# EAGLE schematic Talon_I2C (EAGLE 9.6.2)

## Sheet 1 of 3: Power
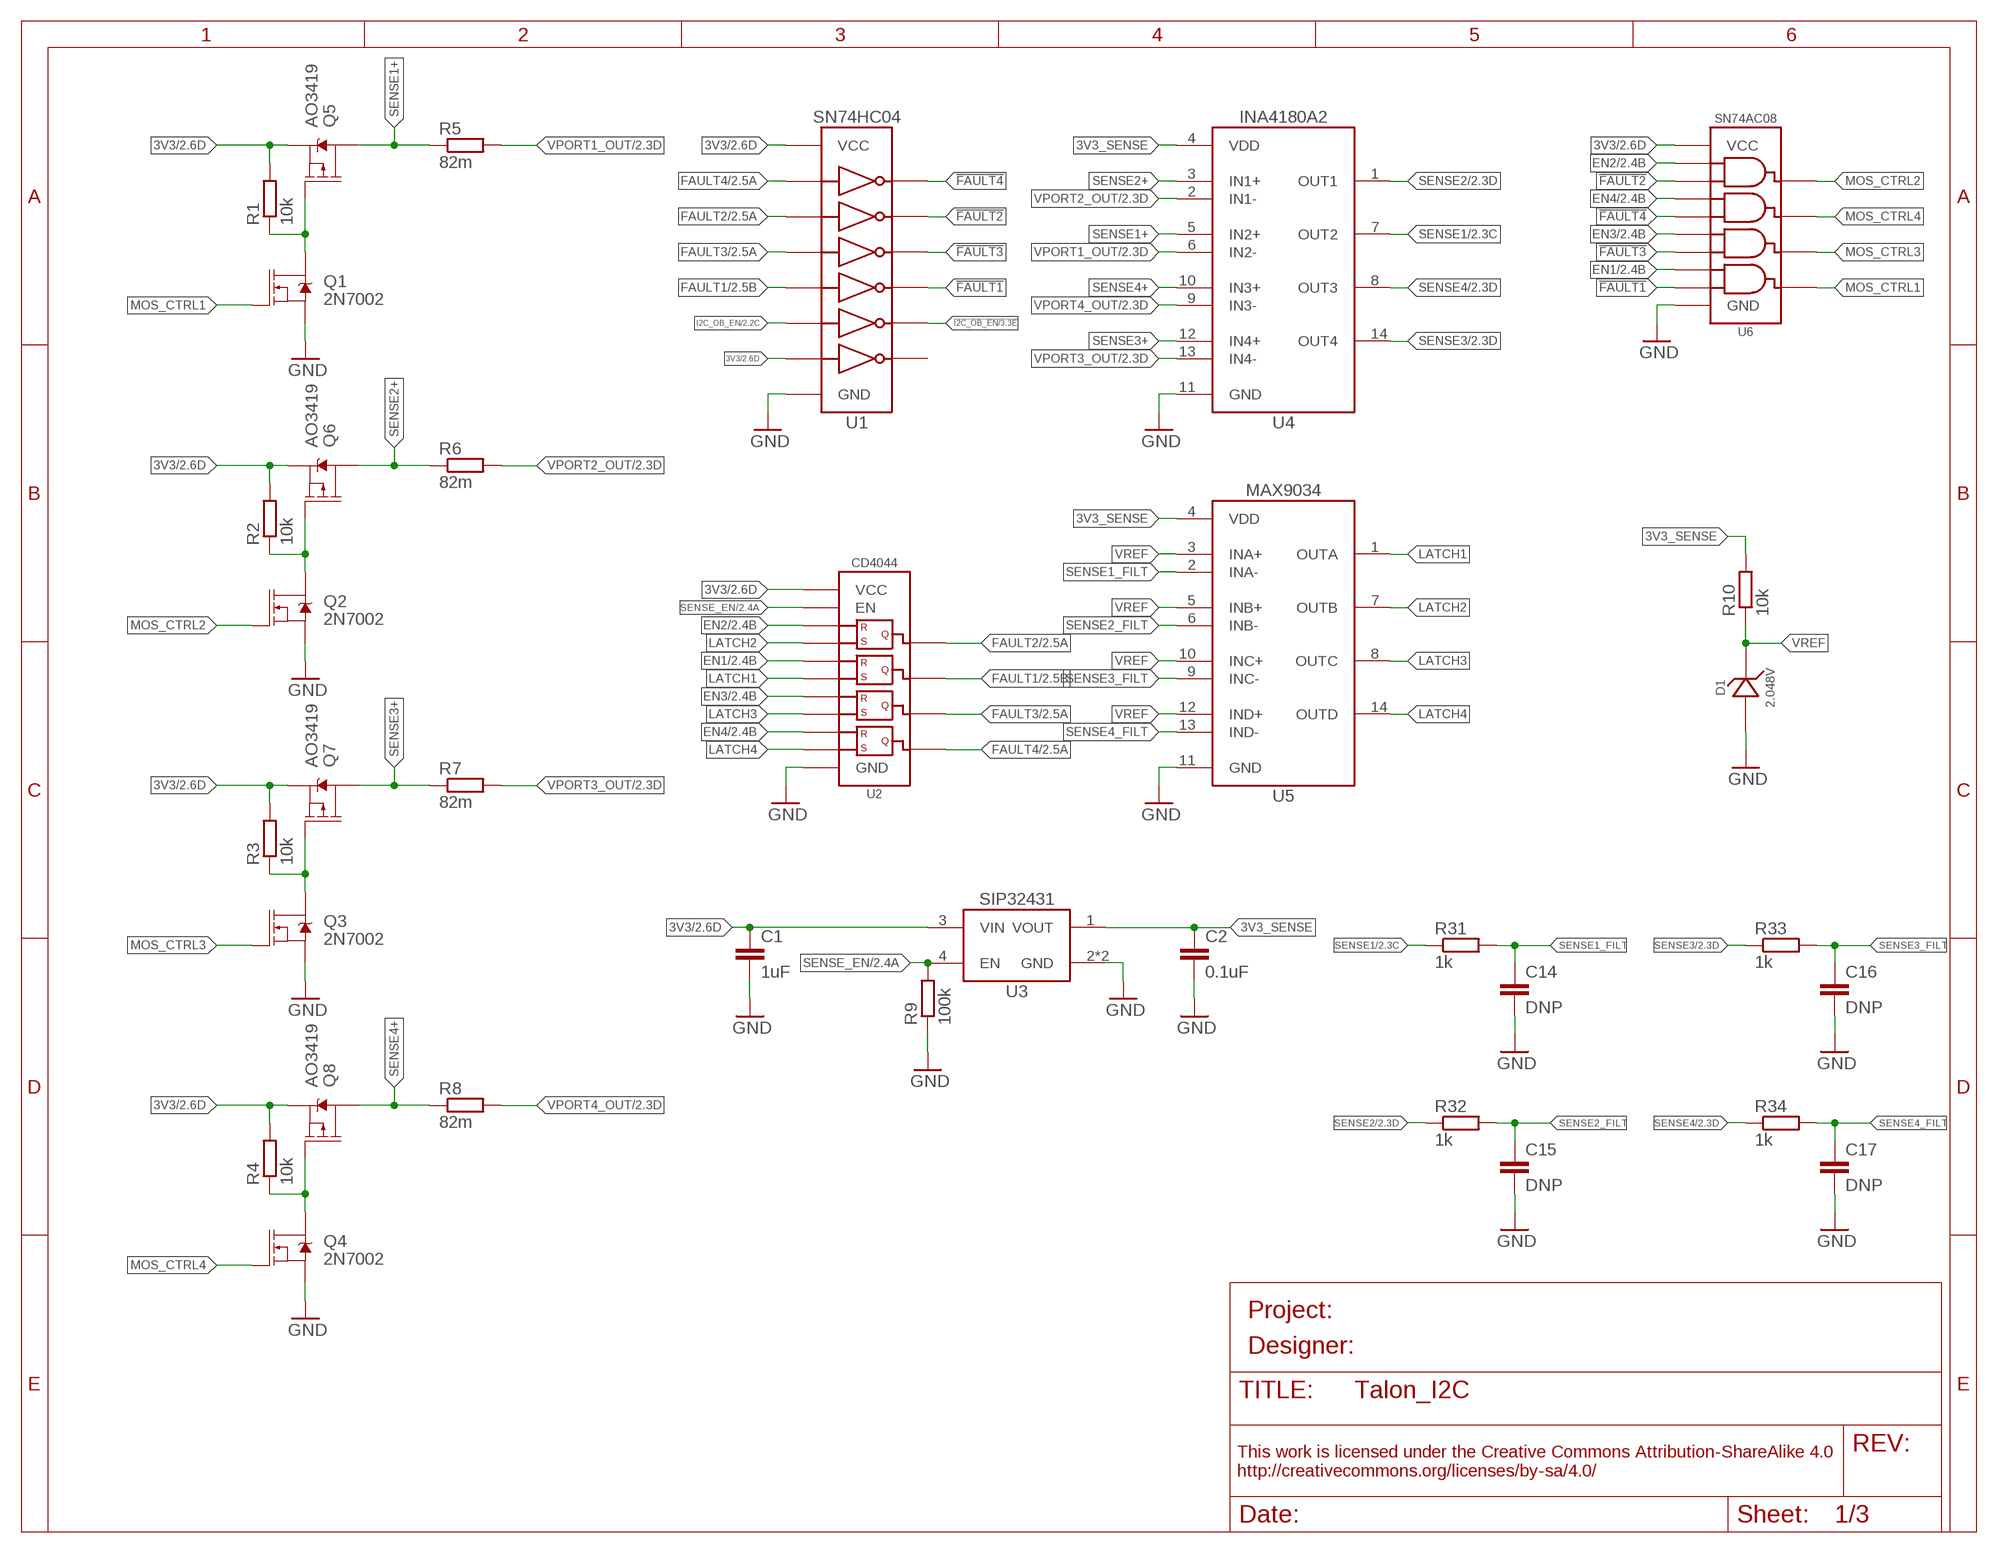
[diagram p0: schematic, sheet 1]

### Parts
C1  1uF  C-EU1UFC0603  [C0603]
C2  0.1uF  C-EU0.1UFC0402  [C0402]
C14  DNP  C-EU0.1UFC0402  [C0402]
C15  DNP  C-EU0.1UFC0402  [C0402]
C16  DNP  C-EU0.1UFC0402  [C0402]
C17  DNP  C-EU0.1UFC0402  [C0402]
D1  2.048V  LM40402.048  [SOT23-3]
Q1  2N7002  MOSFET-NCH-2N7002P  [SOT23-3]
Q2  2N7002  MOSFET-NCH-2N7002P  [SOT23-3]
Q3  2N7002  MOSFET-NCH-2N7002P  [SOT23-3]
Q4  2N7002  MOSFET-NCH-2N7002P  [SOT23-3]
Q5  AO3419  MOSFET-PCH-AO3419  [SOT23-3]
Q6  AO3419  MOSFET-PCH-AO3419  [SOT23-3]
Q7  AO3419  MOSFET-PCH-AO3419  [SOT23-3]
Q8  AO3419  MOSFET-PCH-AO3419  [SOT23-3]
R1  10k  R-EU_10KR0402  [R0402]
R2  10k  R-EU_10KR0402  [R0402]
R3  10k  R-EU_10KR0402  [R0402]
R4  10k  R-EU_10KR0402  [R0402]
R5  82m  R-EU_0.082R0603  [R0603]
R6  82m  R-EU_0.082R0603  [R0603]
R7  82m  R-EU_0.082R0603  [R0603]
R8  82m  R-EU_0.082R0603  [R0603]
R9  100k  R-EU_100KR0402  [R0402]
R10  10k  R-EU_10KR0402  [R0402]
R31  1k  R-EU_1KR0402  [R0402]
R32  1k  R-EU_1KR0402  [R0402]
R33  1k  R-EU_1KR0402  [R0402]
R34  1k  R-EU_1KR0402  [R0402]
U1  SN74HC04  [TSSOP14]
U2  CD4044  [TSSOP16]
U3  SIP32431TDFN  [TDFN_4]
U4  INA4180A2  [TSSOP14]
U5  MAX9034TSSOP  [TSSOP14]
U6  SN74AC08  [TSSOP14]

### Nets
3V3: C1.1 Q5.2(S) Q6.2(S) Q7.2(S) Q8.2(S) R1.2 R2.2 R3.2 R4.2 U1.13(A6) U1.14(VCC) U2.16(VCC) U3.3(VIN) U6.14(VCC) ; also sheet 2,3
3V3_SENSE: C2.1 R10.2 U3.1(VOUT) U4.4(VDD) U5.4(VDD)
!FAULT1: U1.8(Y4) U6.13(B4)
!FAULT2: U1.4(Y2) U6.2(B1)
!FAULT3: U1.6(Y3) U6.10(B3)
!FAULT4: U1.2(Y1) U6.5(B2)
!I2C_OB_EN: U1.10(Y5) ; also sheet 3
EN1: U2.6(R2) U6.12(A4) ; also sheet 2
EN2: U2.4(R1) U6.1(A1) ; also sheet 2
EN3: U2.12(R3) U6.9(A3) ; also sheet 2
EN4: U2.14(R4) U6.4(A2) ; also sheet 2
FAULT1: U1.9(A4) U2.9(Q2) ; also sheet 2
FAULT2: U1.3(A2) U2.13(Q1) ; also sheet 2
FAULT3: U1.5(A3) U2.10(Q3) ; also sheet 2
FAULT4: U1.1(A1) U2.1(Q4) ; also sheet 2
GND: C1.2 C2.2 C14.2 C15.2 C16.2 C17.2 D1.2(A) Q1.2(S) Q2.2(S) Q3.2(S) Q4.2(S) R9.1 U1.7(GND) U2.8(GND) U3.2(GND) U3.EP(GND) U4.11(GND) U5.11(GND) U6.7(GND) ; also sheet 2,3
I2C_OB_EN: U1.11(A5) ; also sheet 2,3
LATCH1: U2.7(S2) U5.1(OUTA)
LATCH2: U2.3(S1) U5.7(OUTB)
LATCH3: U2.11(S3) U5.8(OUTC)
LATCH4: U2.15(S4) U5.14(OUTD)
MOS_CTRL1: Q1.1(G) U6.11(Y4)
MOS_CTRL2: Q2.1(G) U6.3(Y1)
MOS_CTRL3: Q3.1(G) U6.8(Y3)
MOS_CTRL4: Q4.1(G) U6.6(Y2)
N$1: Q2.3(D) Q6.1(G) R2.1
N$2: Q1.3(D) Q5.1(G) R1.1
N$3: Q3.3(D) Q7.1(G) R3.1
N$4: Q4.3(D) Q8.1(G) R4.1
SENSE1: R31.1 U4.7(OUT2) ; also sheet 2
SENSE1+: Q5.3(D) R5.1 U4.5(IN2+)
SENSE1_FILT: C14.1 R31.2 U5.2(INA-)
SENSE2: R32.1 U4.1(OUT1) ; also sheet 2
SENSE2+: Q6.3(D) R6.1 U4.3(IN1+)
SENSE2_FILT: C15.1 R32.2 U5.6(INB-)
SENSE3: R33.1 U4.14(OUT4) ; also sheet 2
SENSE3+: Q7.3(D) R7.1 U4.12(IN4+)
SENSE3_FILT: C16.1 R33.2 U5.9(INC-)
SENSE4: R34.1 U4.8(OUT3) ; also sheet 2
SENSE4+: Q8.3(D) R8.1 U4.10(IN3+)
SENSE4_FILT: C17.1 R34.2 U5.13(IND-)
SENSE_EN: R9.2 U2.5(EN) U3.4(EN) ; also sheet 2
VPORT1_OUT: R5.2 U4.6(IN2-) ; also sheet 2,3
VPORT2_OUT: R6.2 U4.2(IN1-) ; also sheet 2,3
VPORT3_OUT: R7.2 U4.13(IN4-) ; also sheet 2,3
VPORT4_OUT: R8.2 U4.9(IN3-) ; also sheet 2,3
VREF: D1.1(C) R10.1 U5.3(INA+) U5.5(INB+) U5.10(INC+) U5.12(IND+)
Unconnected: U1.12(Y6)

## Sheet 2 of 3: Core
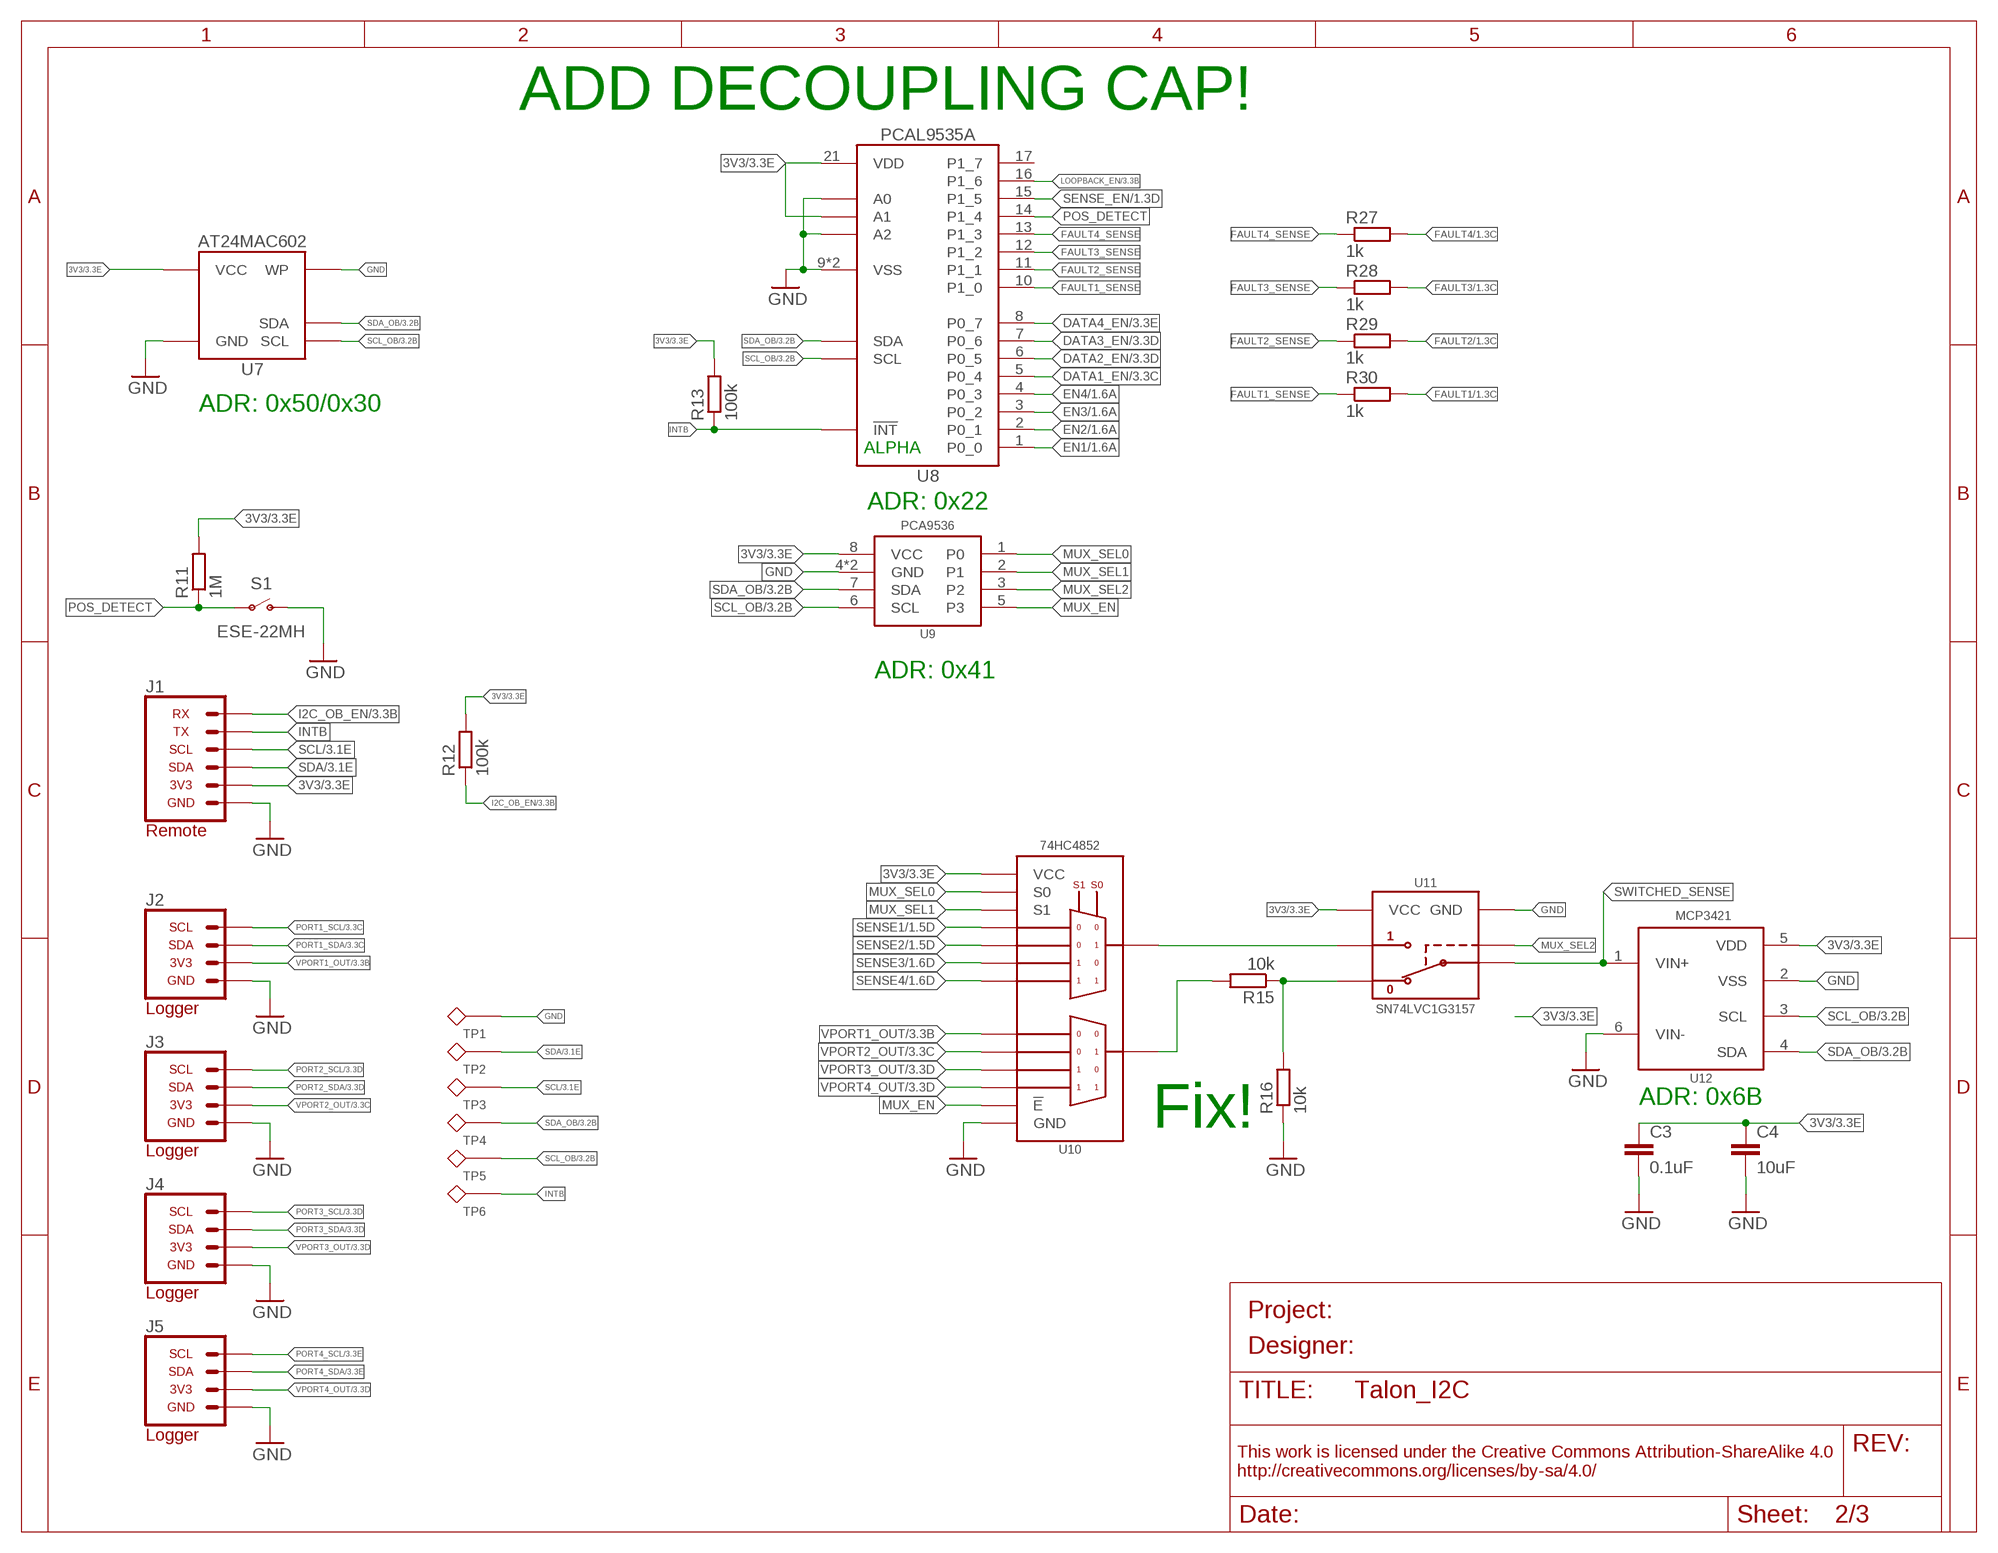
[diagram p1: schematic, sheet 2]

### Parts
C3  0.1uF  C-EU0.1UFC0402  [C0402]
C4  10uF  C-EU10UFC0805  [C0805]
J1  CONN_TALON_REMOTE  [1X06_MICROLOCKPLUS]
J2  CONN_I2C_LOGGER  [1X04_M8_TE_T404103_BOARDLOCK]
J3  CONN_I2C_LOGGER  [1X04_M8_TE_T404103_BOARDLOCK]
J4  CONN_I2C_LOGGER  [1X04_M8_TE_T404103_BOARDLOCK]
J5  CONN_I2C_LOGGER  [1X04_M8_TE_T404103_BOARDLOCK]
R11  1M  R-EU_1MR0402  [R0402]
R12  100k  R-EU_100KR0402  [R0402]
R13  100k  R-EU_100KR0402  [R0402]
R15  10k  R-EU_10KR0402  [R0402]
R16  10k  R-EU_10KR0402  [R0402]
R27  1k  R-EU_1KR0402  [R0402]
R28  1k  R-EU_1KR0402  [R0402]
R29  1k  R-EU_1KR0402  [R0402]
R30  1k  R-EU_1KR0402  [R0402]
S1  ESE-22MH  SPSTESE-22MH  [ESE-22MH]
TP1  TESTPOINTRCU  [TESTPOINT_0603]
TP2  TESTPOINTRCU  [TESTPOINT_0603]
TP3  TESTPOINTRCU  [TESTPOINT_0603]
TP4  TESTPOINTRCU  [TESTPOINT_0603]
TP5  TESTPOINTRCU  [TESTPOINT_0603]
TP6  TESTPOINTRCU  [TESTPOINT_0603]
U7  AT24MAC602SOT23  [SOT23-5]
U8  PCAL9535AQFN  [QFN24]
U9  PCA9536DFN  [DFN_8_3X3]
U10  74HC4852  [VQFN-16]
U11  SN74LVC1G3157SC70  [DCK_R-PDSO-G6]
U12  MCP3421A3  [SOT23-6L]

### Nets
3V3: C3.1 C4.1 J1.2(3V3) R11.2 R12.2 R13.2 U7.4(VCC) U8.21(VDD) U8.23(A1) U9.8(VCC) U10.16(VCC) U11.5(VCC) U12.5(VDD) ; also sheet 1,3
DATA1_EN: U8.5(P0_4) ; also sheet 3
DATA2_EN: U8.6(P0_5) ; also sheet 3
DATA3_EN: U8.7(P0_6) ; also sheet 3
DATA4_EN: U8.8(P0_7) ; also sheet 3
EN1: U8.1(P0_0) ; also sheet 1
EN2: U8.2(P0_1) ; also sheet 1
EN3: U8.3(P0_2) ; also sheet 1
EN4: U8.4(P0_3) ; also sheet 1
FAULT1: R30.2 ; also sheet 1
FAULT1_SENSE: R30.1 U8.10(P1_0)
FAULT2: R29.2 ; also sheet 1
FAULT2_SENSE: R29.1 U8.11(P1_1)
FAULT3: R28.2 ; also sheet 1
FAULT3_SENSE: R28.1 U8.12(P1_2)
FAULT4: R27.2 ; also sheet 1
FAULT4_SENSE: R27.1 U8.13(P1_3)
GND: C3.2 C4.2 J1.1(GND) J2.4(GND) J3.4(GND) J4.4(GND) J5.4(GND) R16.1 S1.1(O) TP1.1 U7.2(GND) U7.5(WP) U8.9(VSS) U8.18(A0) U8.24(A2) U8.EP(VSS) U9.4(GND) U9.EP(GND) U10.8(GND) U10.EP(GND) U11.2(GND) U12.2(VSS) U12.6(VIN-) ; also sheet 1,3
I2C_OB_EN: J1.6(RX) R12.1 ; also sheet 1,3
INTB: J1.5(TX) R13.1 TP6.1 U8.22(!INT)
LOOPBACK_EN: U8.16(P1_6) ; also sheet 3
MUX_EN: U9.5(P3) U10.6(!E)
MUX_SEL0: U9.1(P0) U10.10(S0)
MUX_SEL1: U9.2(P1) U10.9(S1)
MUX_SEL2: U9.3(P2) U11.6(S)
N$5: R15.2 U10.3(2Z)
N$6: R15.1 R16.2 U11.3(B1)
N$38: U10.13(1Z) U11.1(B2)
PORT1_SCL: J2.3(SCL) ; also sheet 3
PORT1_SDA: J2.1(SDA) ; also sheet 3
PORT2_SCL: J3.3(SCL) ; also sheet 3
PORT2_SDA: J3.1(SDA) ; also sheet 3
PORT3_SCL: J4.3(SCL) ; also sheet 3
PORT3_SDA: J4.1(SDA) ; also sheet 3
PORT4_SCL: J5.3(SCL) ; also sheet 3
PORT4_SDA: J5.1(SDA) ; also sheet 3
POS_DETECT: R11.1 S1.2(P) U8.14(P1_4)
SCL: J1.4(SCL) TP3.1 ; also sheet 3
SCL_OB: TP5.1 U7.1(SCL) U8.19(SCL) U9.6(SCL) U12.3(SCL) ; also sheet 3
SDA: J1.3(SDA) TP2.1 ; also sheet 3
SDA_OB: TP4.1 U7.3(SDA) U8.20(SDA) U9.7(SDA) U12.4(SDA) ; also sheet 3
SENSE1: U10.12(1Y0) ; also sheet 1
SENSE2: U10.14(1Y1) ; also sheet 1
SENSE3: U10.15(1Y2) ; also sheet 1
SENSE4: U10.11(1Y3) ; also sheet 1
SENSE_EN: U8.15(P1_5) ; also sheet 1
SWITCHED_SENSE: U11.4(A) U12.1(VIN+)
VPORT1_OUT: J2.2(3V3) U10.1(2Y0) ; also sheet 1,3
VPORT2_OUT: J3.2(3V3) U10.5(2Y1) ; also sheet 1,3
VPORT3_OUT: J4.2(3V3) U10.2(2Y2) ; also sheet 1,3
VPORT4_OUT: J5.2(3V3) U10.4(2Y3) ; also sheet 1,3
Unconnected: U8.17(P1_7)

### Notes on the sheet
- ADD DECOUPLING CAP!
- ADR: 0x50/0x30
- ALPHA
- ADR: 0x22
- ADR: 0x41
- Fix! | ADR: 0x6B

## Sheet 3 of 3: I2C Interface
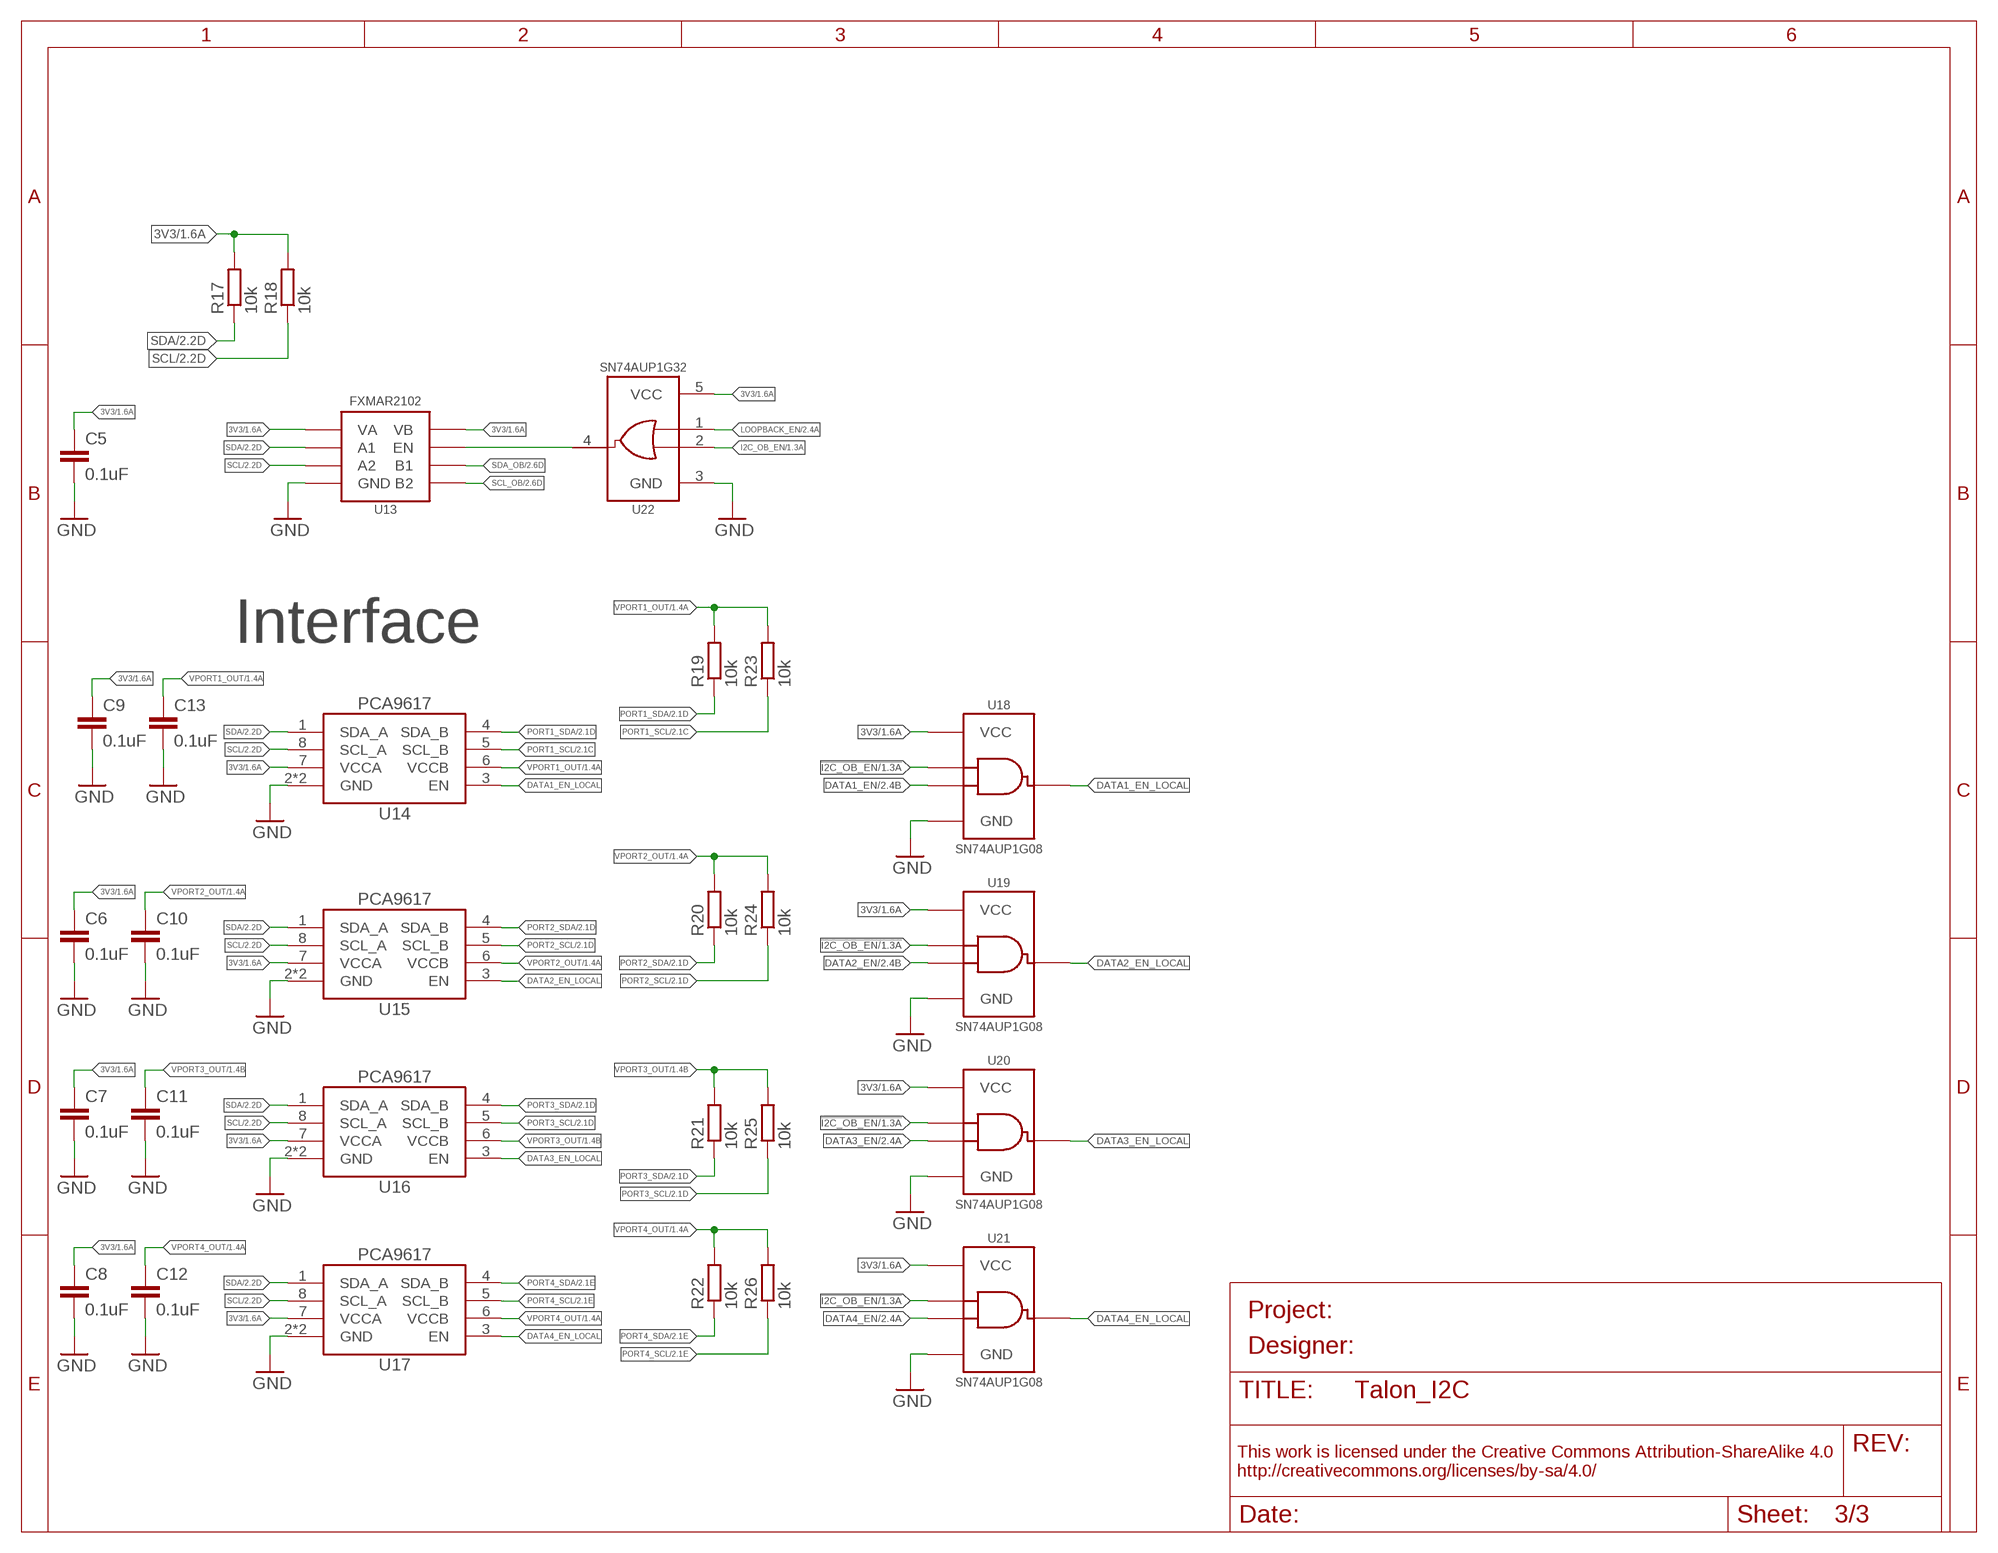
[diagram p2: schematic, sheet 3]

### Parts
C5  0.1uF  C-EU0.1UFC0402  [C0402]
C6  0.1uF  C-EU0.1UFC0402  [C0402]
C7  0.1uF  C-EU0.1UFC0402  [C0402]
C8  0.1uF  C-EU0.1UFC0402  [C0402]
C9  0.1uF  C-EU0.1UFC0402  [C0402]
C10  0.1uF  C-EU0.1UFC0402  [C0402]
C11  0.1uF  C-EU0.1UFC0402  [C0402]
C12  0.1uF  C-EU0.1UFC0402  [C0402]
C13  0.1uF  C-EU0.1UFC0402  [C0402]
R17  10k  R-EU_10KR0402  [R0402]
R18  10k  R-EU_10KR0402  [R0402]
R19  10k  R-EU_10KR0402  [R0402]
R20  10k  R-EU_10KR0402  [R0402]
R21  10k  R-EU_10KR0402  [R0402]
R22  10k  R-EU_10KR0402  [R0402]
R23  10k  R-EU_10KR0402  [R0402]
R24  10k  R-EU_10KR0402  [R0402]
R25  10k  R-EU_10KR0402  [R0402]
R26  10k  R-EU_10KR0402  [R0402]
U13  FXMAR2102UMLP  [UQFN-8_1.4X1.2]
U14  PCA9617WSON  [WSON-8_2X3]
U15  PCA9617WSON  [WSON-8_2X3]
U16  PCA9617WSON  [WSON-8_2X3]
U17  PCA9617WSON  [WSON-8_2X3]
U18  SN74AUP1G08DCK  [DCK_R-PDSO-G5]
U19  SN74AUP1G08DCK  [DCK_R-PDSO-G5]
U20  SN74AUP1G08DCK  [DCK_R-PDSO-G5]
U21  SN74AUP1G08DCK  [DCK_R-PDSO-G5]
U22  SN74AUP1G32DCK  [DCK_R-PDSO-G5]

### Nets
3V3: C5.1 C6.1 C7.1 C8.1 C9.1 R17.2 R18.2 U13.1(VA) U13.8(VB) U14.7(VCCA) U15.7(VCCA) U16.7(VCCA) U17.7(VCCA) U18.5(VCC) U19.5(VCC) U20.5(VCC) U21.5(VCC) U22.5(VCC) ; also sheet 1,2
!I2C_OB_EN: U18.1(A) U19.1(A) U20.1(A) U21.1(A) ; also sheet 1
DATA1_EN: U18.2(B) ; also sheet 2
DATA1_EN_LOCAL: U14.3(EN) U18.4(Y)
DATA2_EN: U19.2(B) ; also sheet 2
DATA2_EN_LOCAL: U15.3(EN) U19.4(Y)
DATA3_EN: U20.2(B) ; also sheet 2
DATA3_EN_LOCAL: U16.3(EN) U20.4(Y)
DATA4_EN: U21.2(B) ; also sheet 2
DATA4_EN_LOCAL: U17.3(EN) U21.4(Y)
GND: C5.2 C6.2 C7.2 C8.2 C9.2 C10.2 C11.2 C12.2 C13.2 U13.4(GND) U14.2(GND) U14.EP(GND) U15.2(GND) U15.EP(GND) U16.2(GND) U16.EP(GND) U17.2(GND) U17.EP(GND) U18.3(GND) U19.3(GND) U20.3(GND) U21.3(GND) U22.3(GND) ; also sheet 1,2
I2C_OB_EN: U22.2(B) ; also sheet 1,2
LOOPBACK_EN: U22.1(A) ; also sheet 2
N$7: U13.5(EN) U22.4(Y)
PORT1_SCL: R23.1 U14.5(SCL_B) ; also sheet 2
PORT1_SDA: R19.1 U14.4(SDA_B) ; also sheet 2
PORT2_SCL: R24.1 U15.5(SCL_B) ; also sheet 2
PORT2_SDA: R20.1 U15.4(SDA_B) ; also sheet 2
PORT3_SCL: R25.1 U16.5(SCL_B) ; also sheet 2
PORT3_SDA: R21.1 U16.4(SDA_B) ; also sheet 2
PORT4_SCL: R26.1 U17.5(SCL_B) ; also sheet 2
PORT4_SDA: R22.1 U17.4(SDA_B) ; also sheet 2
SCL: R18.1 U13.3(A2) U14.8(SCL_A) U15.8(SCL_A) U16.8(SCL_A) U17.8(SCL_A) ; also sheet 2
SCL_OB: U13.6(B2) ; also sheet 2
SDA: R17.1 U13.2(A1) U14.1(SDA_A) U15.1(SDA_A) U16.1(SDA_A) U17.1(SDA_A) ; also sheet 2
SDA_OB: U13.7(B1) ; also sheet 2
VPORT1_OUT: C13.1 R19.2 R23.2 U14.6(VCCB) ; also sheet 1,2
VPORT2_OUT: C10.1 R20.2 R24.2 U15.6(VCCB) ; also sheet 1,2
VPORT3_OUT: C11.1 R21.2 R25.2 U16.6(VCCB) ; also sheet 1,2
VPORT4_OUT: C12.1 R22.2 R26.2 U17.6(VCCB) ; also sheet 1,2

### Notes on the sheet
- Interface

## Library data of the parts
C1 = bschulz_passives:C-EU: CAPACITOR, European symbol; DIGIKEY: 587-1251-1-ND; MF: Yaiyo Yuden; MPN: EMK107BJ105KA-T
C2 C3 C5-C13 = bschulz_passives:C-EU: CAPACITOR, European symbol; DIGIKEY: 490-4759-1-ND; MF: Murata; MPN: GCM155R71C104KA55D
C4 = bschulz_passives:C-EU: CAPACITOR, European symbol; DIGIKEY: 490-6473-1-ND; MF: Murata; MPN: GRM21BR61C106KE15K
C14-C17 = bschulz_passives:C-EU: CAPACITOR, European symbol; DIGIKEY: DNP; MF: N/A; MPN: DNP
D1 = bschulz:LM4040: LM4040 - Precision Micropower Shunt Voltage Referance Characteristics: VReverseBreakdown: 1.225V, 2.5V, 4.096V, 5.0V Output Current: 15 mA Tolerance: 1% Temp Coeficient: ±15ppm/C° Operating Temperature: -40°C to 85°C Digikey: 576-1047-1-ND (Microchip, 2.5V) <https://www.digikey.com/product-detail/en/microchip-technology/LM4040DYM3-2.5-TR/576-1047-1-ND/771818> 576-1048-1-ND (Microchip, 4.096V) <https://www.digikey.com/product-detail/en/microchip-technology/LM4040DYM3-4.1-TR/576-1048-1-ND/771819> 5LM4040CIM3-2.0/NOPBCT-ND (TI, 2.048V) <https://www.digikey.com/product-detail/en/texas-instruments/LM4040CIM3-2.0-NOPB/LM4040CIM3-2.0-NOPBCT-ND/2350623>; DIGIKEY: LM4040CIM3-2.0/NOPBCT-ND; MF: TI; MPN: LM4040CIM3-2.0/NOPB
J1 = GEMS_Plugs:CONN_TALON: GEMS Connector for Talon Interface; DIGIKEY: 900-2059570671CT-ND; DISP: Remote; MF: Molex; MPN: 2059570671
J2-J5 = GEMS_Plugs:CONN_I2C_LOGGER: GEMS Connector for I2C Devices - Logger Side; DIGIKEY: A126815-ND; DISP: Logger; MF: TE; MPN: T4041037041-000
Q1-Q4 = bschulz:MOSFET-NCH: N-channel MOSFET Small Signal/Low Power: BSS138 2N7002P 2N7002PW RE1C002UN; DIGIKEY: 1727-4692-1-ND; MF: Nexperia; MPN: 2N7002P,215
Q5-Q8 = bschulz:MOSFET-PCH: P-channel MOSFET Small Signal/Low Power:; DIGIKEY: 785-1013-1-ND; MF: Alpha and Omega; MPN: AO3419
R1-R4 R10 R15-R26 = bschulz_passives:R-EU_: RESISTOR, European symbol Digikey Parts: Yageo, 0402 <https://www.digikey.com/products/en/resistors/chip-resistor-surface-mount/52?k=&pkeyword=&sv=0&s=4356&sf=1&FV=-1%7C13%2C7%7C2%2C1291%7C39157%2C1989%7C0%2C-8%7C52%2C3%7C1131%2C3%7C2503&quantity=&ColumnSort=0&page=1&stock=1&pageSize=25> Yageo, 0603 <https://www.digikey.com/products/en/resistors/chip-resistor-surface-mount/52?k=&pkeyword=&sv=0&pv1291=39245&sf=1&FV=-5%7C4356%2C-5%7C47360%2C-8%7C52%2C-1%7C13%2C7%7C2%2C1989%7C0&quantity=10&ColumnSort=1000011&page=1&stock=1&pageSize=25> Panasonic, 0603 <https://www.digikey.com/products/en/resistors/chip-resistor-surface-mount/52?k=&pkeyword=&pv252=68&sf=0&FV=ffec373d%2C1c0002%2C142c040c%2C1f140000%2Cffe00034%2C80002%2Cc0001&quantity=&ColumnSort=0&page=1&stock=1&pageSize=25> Panasonic, precision, 0603 <https://www.digikey.com/products/en/resistors/chip-resistor-surface-mount/52?FV=ffec4907%2Cfffc000a%2Cc0172%2C142c040c%2C1f140000%2Cffe00034%2C1c0002&quantity=100&ColumnSort=2085&page=1&stock=1&pageSize=25> Panasonic, 0805 <https://www.digikey.com/products/en/resistors/chip-resistor-surface-mount/52?k=&pkeyword=&pv3=1&sf=0&FV=ffec373d%2C1c0002%2C1f140000%2Cffe00034%2C142c040d&quantity=&ColumnSort=0&page=1&stock=1&pageSize=25> Rohm, current sense <https://www.digikey.com/products/en/resistors/chip-resistor-surface-mount/52?k=&pkeyword=&pv3=1&sf=0&FV=ffecb688%2C1f140000%2Cffe00034%2C1c0002&quantity=&ColumnSort=0&page=1&stock=1&pageSize=25> Vishay, pulse proof automotive <https://www.digikey.com/products/en/resistors/chip-resistor-surface-mount/52?k=&pkeyword=&pv7=2&sf=0&FV=ffec5d6b%2Cffe00034%2C1f140000&quantity=&ColumnSort=0&page=1&stock=1&pageSize=25>; DIGIKEY: 311-10.0KLRCT-ND; MF: Yageo; MPN: RC0402FR-0710KL; VALUE_PART: 10k
R5-R8 = bschulz_passives:R-EU_: RESISTOR, European symbol Digikey Parts: Yageo, 0402 <https://www.digikey.com/products/en/resistors/chip-resistor-surface-mount/52?k=&pkeyword=&sv=0&s=4356&sf=1&FV=-1%7C13%2C7%7C2%2C1291%7C39157%2C1989%7C0%2C-8%7C52%2C3%7C1131%2C3%7C2503&quantity=&ColumnSort=0&page=1&stock=1&pageSize=25> Yageo, 0603 <https://www.digikey.com/products/en/resistors/chip-resistor-surface-mount/52?k=&pkeyword=&sv=0&pv1291=39245&sf=1&FV=-5%7C4356%2C-5%7C47360%2C-8%7C52%2C-1%7C13%2C7%7C2%2C1989%7C0&quantity=10&ColumnSort=1000011&page=1&stock=1&pageSize=25> Panasonic, 0603 <https://www.digikey.com/products/en/resistors/chip-resistor-surface-mount/52?k=&pkeyword=&pv252=68&sf=0&FV=ffec373d%2C1c0002%2C142c040c%2C1f140000%2Cffe00034%2C80002%2Cc0001&quantity=&ColumnSort=0&page=1&stock=1&pageSize=25> Panasonic, precision, 0603 <https://www.digikey.com/products/en/resistors/chip-resistor-surface-mount/52?FV=ffec4907%2Cfffc000a%2Cc0172%2C142c040c%2C1f140000%2Cffe00034%2C1c0002&quantity=100&ColumnSort=2085&page=1&stock=1&pageSize=25> Panasonic, 0805 <https://www.digikey.com/products/en/resistors/chip-resistor-surface-mount/52?k=&pkeyword=&pv3=1&sf=0&FV=ffec373d%2C1c0002%2C1f140000%2Cffe00034%2C142c040d&quantity=&ColumnSort=0&page=1&stock=1&pageSize=25> Rohm, current sense <https://www.digikey.com/products/en/resistors/chip-resistor-surface-mount/52?k=&pkeyword=&pv3=1&sf=0&FV=ffecb688%2C1f140000%2Cffe00034%2C1c0002&quantity=&ColumnSort=0&page=1&stock=1&pageSize=25> Vishay, pulse proof automotive <https://www.digikey.com/products/en/resistors/chip-resistor-surface-mount/52?k=&pkeyword=&pv7=2&sf=0&FV=ffec5d6b%2Cffe00034%2C1f140000&quantity=&ColumnSort=0&page=1&stock=1&pageSize=25>; DIGIKEY: 408-1446-1-ND; MF: Susumu; MPN: RL0816T-R082-F; VALUE_PART: 82m
R9 R12 R13 = bschulz_passives:R-EU_: RESISTOR, European symbol Digikey Parts: Yageo, 0402 <https://www.digikey.com/products/en/resistors/chip-resistor-surface-mount/52?k=&pkeyword=&sv=0&s=4356&sf=1&FV=-1%7C13%2C7%7C2%2C1291%7C39157%2C1989%7C0%2C-8%7C52%2C3%7C1131%2C3%7C2503&quantity=&ColumnSort=0&page=1&stock=1&pageSize=25> Yageo, 0603 <https://www.digikey.com/products/en/resistors/chip-resistor-surface-mount/52?k=&pkeyword=&sv=0&pv1291=39245&sf=1&FV=-5%7C4356%2C-5%7C47360%2C-8%7C52%2C-1%7C13%2C7%7C2%2C1989%7C0&quantity=10&ColumnSort=1000011&page=1&stock=1&pageSize=25> Panasonic, 0603 <https://www.digikey.com/products/en/resistors/chip-resistor-surface-mount/52?k=&pkeyword=&pv252=68&sf=0&FV=ffec373d%2C1c0002%2C142c040c%2C1f140000%2Cffe00034%2C80002%2Cc0001&quantity=&ColumnSort=0&page=1&stock=1&pageSize=25> Panasonic, precision, 0603 <https://www.digikey.com/products/en/resistors/chip-resistor-surface-mount/52?FV=ffec4907%2Cfffc000a%2Cc0172%2C142c040c%2C1f140000%2Cffe00034%2C1c0002&quantity=100&ColumnSort=2085&page=1&stock=1&pageSize=25> Panasonic, 0805 <https://www.digikey.com/products/en/resistors/chip-resistor-surface-mount/52?k=&pkeyword=&pv3=1&sf=0&FV=ffec373d%2C1c0002%2C1f140000%2Cffe00034%2C142c040d&quantity=&ColumnSort=0&page=1&stock=1&pageSize=25> Rohm, current sense <https://www.digikey.com/products/en/resistors/chip-resistor-surface-mount/52?k=&pkeyword=&pv3=1&sf=0&FV=ffecb688%2C1f140000%2Cffe00034%2C1c0002&quantity=&ColumnSort=0&page=1&stock=1&pageSize=25> Vishay, pulse proof automotive <https://www.digikey.com/products/en/resistors/chip-resistor-surface-mount/52?k=&pkeyword=&pv7=2&sf=0&FV=ffec5d6b%2Cffe00034%2C1f140000&quantity=&ColumnSort=0&page=1&stock=1&pageSize=25>; DIGIKEY: 311-100KLRCT-ND; MF: Yageo; MPN: RC0402FR-07100KL; VALUE_PART: 100k
R11 = bschulz_passives:R-EU_: RESISTOR, European symbol Digikey Parts: Yageo, 0402 <https://www.digikey.com/products/en/resistors/chip-resistor-surface-mount/52?k=&pkeyword=&sv=0&s=4356&sf=1&FV=-1%7C13%2C7%7C2%2C1291%7C39157%2C1989%7C0%2C-8%7C52%2C3%7C1131%2C3%7C2503&quantity=&ColumnSort=0&page=1&stock=1&pageSize=25> Yageo, 0603 <https://www.digikey.com/products/en/resistors/chip-resistor-surface-mount/52?k=&pkeyword=&sv=0&pv1291=39245&sf=1&FV=-5%7C4356%2C-5%7C47360%2C-8%7C52%2C-1%7C13%2C7%7C2%2C1989%7C0&quantity=10&ColumnSort=1000011&page=1&stock=1&pageSize=25> Panasonic, 0603 <https://www.digikey.com/products/en/resistors/chip-resistor-surface-mount/52?k=&pkeyword=&pv252=68&sf=0&FV=ffec373d%2C1c0002%2C142c040c%2C1f140000%2Cffe00034%2C80002%2Cc0001&quantity=&ColumnSort=0&page=1&stock=1&pageSize=25> Panasonic, precision, 0603 <https://www.digikey.com/products/en/resistors/chip-resistor-surface-mount/52?FV=ffec4907%2Cfffc000a%2Cc0172%2C142c040c%2C1f140000%2Cffe00034%2C1c0002&quantity=100&ColumnSort=2085&page=1&stock=1&pageSize=25> Panasonic, 0805 <https://www.digikey.com/products/en/resistors/chip-resistor-surface-mount/52?k=&pkeyword=&pv3=1&sf=0&FV=ffec373d%2C1c0002%2C1f140000%2Cffe00034%2C142c040d&quantity=&ColumnSort=0&page=1&stock=1&pageSize=25> Rohm, current sense <https://www.digikey.com/products/en/resistors/chip-resistor-surface-mount/52?k=&pkeyword=&pv3=1&sf=0&FV=ffecb688%2C1f140000%2Cffe00034%2C1c0002&quantity=&ColumnSort=0&page=1&stock=1&pageSize=25> Vishay, pulse proof automotive <https://www.digikey.com/products/en/resistors/chip-resistor-surface-mount/52?k=&pkeyword=&pv7=2&sf=0&FV=ffec5d6b%2Cffe00034%2C1f140000&quantity=&ColumnSort=0&page=1&stock=1&pageSize=25>; DIGIKEY: 311-1.00MLRCT-ND; MF: Yageo; MPN: RC0402FR-071ML; VALUE_PART: 1M
R27-R34 = bschulz_passives:R-EU_: RESISTOR, European symbol Digikey Parts: Yageo, 0402 <https://www.digikey.com/products/en/resistors/chip-resistor-surface-mount/52?k=&pkeyword=&sv=0&s=4356&sf=1&FV=-1%7C13%2C7%7C2%2C1291%7C39157%2C1989%7C0%2C-8%7C52%2C3%7C1131%2C3%7C2503&quantity=&ColumnSort=0&page=1&stock=1&pageSize=25> Yageo, 0603 <https://www.digikey.com/products/en/resistors/chip-resistor-surface-mount/52?k=&pkeyword=&sv=0&pv1291=39245&sf=1&FV=-5%7C4356%2C-5%7C47360%2C-8%7C52%2C-1%7C13%2C7%7C2%2C1989%7C0&quantity=10&ColumnSort=1000011&page=1&stock=1&pageSize=25> Panasonic, 0603 <https://www.digikey.com/products/en/resistors/chip-resistor-surface-mount/52?k=&pkeyword=&pv252=68&sf=0&FV=ffec373d%2C1c0002%2C142c040c%2C1f140000%2Cffe00034%2C80002%2Cc0001&quantity=&ColumnSort=0&page=1&stock=1&pageSize=25> Panasonic, precision, 0603 <https://www.digikey.com/products/en/resistors/chip-resistor-surface-mount/52?FV=ffec4907%2Cfffc000a%2Cc0172%2C142c040c%2C1f140000%2Cffe00034%2C1c0002&quantity=100&ColumnSort=2085&page=1&stock=1&pageSize=25> Panasonic, 0805 <https://www.digikey.com/products/en/resistors/chip-resistor-surface-mount/52?k=&pkeyword=&pv3=1&sf=0&FV=ffec373d%2C1c0002%2C1f140000%2Cffe00034%2C142c040d&quantity=&ColumnSort=0&page=1&stock=1&pageSize=25> Rohm, current sense <https://www.digikey.com/products/en/resistors/chip-resistor-surface-mount/52?k=&pkeyword=&pv3=1&sf=0&FV=ffecb688%2C1f140000%2Cffe00034%2C1c0002&quantity=&ColumnSort=0&page=1&stock=1&pageSize=25> Vishay, pulse proof automotive <https://www.digikey.com/products/en/resistors/chip-resistor-surface-mount/52?k=&pkeyword=&pv7=2&sf=0&FV=ffec5d6b%2Cffe00034%2C1f140000&quantity=&ColumnSort=0&page=1&stock=1&pageSize=25>; DIGIKEY: 311-1.00KLRCT-ND; MF: Yageo; MPN: RC0402FR-071KL; VALUE_PART: 1k
S1 = bschulz:SPST: Generic SPST (Single Pole Single Throw) Switch; DIGIKEY: P13584SCT-ND; MF: Panasonic; MPN: ESE-22MH24
TP1-TP6 = bschulz:TESTPOINT: Test Point; DIGIKEY: A106145CT-ND; MF: TE Connectivity; MPN: RCU-0C
U1 = bschulz:SN74HC04: SN74HC04 - NOT, 4 Element, 1 Input - Hex Inverter Characteristics: VCC: 2 ~ 6Vv IQ = <2μA Operating Temperature: -40°C to 85°C Digikey: 296-8208-1-ND <https://www.digikey.com/en/products/detail/texas-instruments/SN74HC04PWR/377033>; DIGIKEY: 296-8208-1-ND; MF: TI; MPN: SN74HC04PWR
U2 = bschulz:CD404*: CD404x - S-R Latch, Quad Characteristics: VCC: 3 ~ 18V Operating Temperature: -40°C to 85°C Digikey: CD4044 <https://www.digikey.com/en/products/detail/texas-instruments/CD4044BPWR/1691075>; DIGIKEY: 296-31499-1-ND; DISP: CD4044; MF: TI; MPN: CD4044BPWR
U3 = bschulz:SIP3243*: SiP3243x - Ultra Low Leakage Load Switch with Reverse Blocking Characteristics: Vin: 1.5 ~ 5.5V IQ: 0.01 nA RDS(ON): 105mΩ (Vin = 5v), 135mΩ (Vin = 3v) Output Current: 1.4A Operating Temperature: -40°C to 125°C Digikey: SIP32431DNP3-T1GE4CT-ND <https://www.digikey.com/en/products/detail/SIP32431DNP3-T1GE4/SIP32431DNP3-T1GE4CT-ND/2673920?itemSeq=377306935>; DIGIKEY: SIP32431DNP3-T1GE4CT-ND; DISP: SIP32431; MF: Vishay; MPN: SIP32431DNP3-T1GE4
U4 = bschulz:INA4180: INA4180 - Analog Output Current Sense Amplifier Characteristics: Vs: 2.7V ~ 5V Iq: 690μA Common Mode Range: 0V ~ 26V Gain: 20, 50, 100, 200 V/V (A1, A2, A3, A4) Operating Temperature: -40°C to 125°C Digikey: INA4180A2 <https://www.digikey.com/en/products/detail/texas-instruments/INA4180A2IPWR/8676289>; DIGIKEY: 296-49095-1-ND; DISP: INA4180A2; MF: TI; MPN: INA4180A2IPWR
U5 = bschulz:MAX9034: MAX9034 - Ultra-Small nanoPower Single Comparator , Quad Characteristics: Vin: 2.5V ~ 5.5V Response Time: 188ns IQ: 35μA Internal Ref Operating Temperature: -40°C to 85°C Digikey: MAX9034AUD+CT-ND (TSSOP) <https://www.digikey.com/en/products/detail/maxim-integrated/MAX9034AUD-T/1498905>; DIGIKEY: MAX9034AUD+CT-ND; DISP: MAX9034; MF: Maxim; MPN: MAX9034AUD+T
U6 = bschulz:SN74AC08: SN74AC08 - AND, 4 Element, 2 Input Characteristics: VCC: 2 ~ 6V IQ = <2μA Operating Temperature: -40°C to 85°C Digikey: 296-4292-1-ND <https://www.digikey.com/en/products/detail/texas-instruments/SN74AC08PWR/376110>; DIGIKEY: 296-4292-1-ND; MF: TI; MPN: SN74AC08PWR
U7 = bschulz:AT24MAC*02: AT24MACx02 - 2kb I2C Serial EEPROM with EUI serial number Characteristics: Vcc: 1.7V ~ 5.5V Memory: 2kb (256 x 8 bit) IQ: 1μA Temperature: -40°C to 85°C Digikey: AT24MAC602-STUM-T (SOT-23, EUI-64) <https://www.digikey.com/en/products/detail/microchip-technology/AT24MAC602-STUM-T/3973073?s=N4IgTCBcDaIIIBUwBYCycDCA2ADGAtAMoICqq%2BCIAugL5A>; DIGIKEY: AT24MAC602-STUM-TCT-ND; DISP: AT24MAC602; MF: Microchip; MPN: AT24MAC602-STUM-T
U8 = bschulz:PCAL95*5A: PCAL95*5A - I2C I/O Expander, 16 bit wtih interrupt and agile IO Characteristics: Vcc: 1.65V ~ 5.5V IOut: 25 mA IQ: 1μA Operating Temperature: -40°C to 85°C Internal Configurable Pullups/Pulldown* Digikey: 568-9947-1-ND (PCAL9535A, QFN) <https://www.digikey.com/en/products/detail/nxp-usa-inc/PCAL9535AHF-128/3721166> 568-9952-1-ND (PCAL9555A, QFN) <https://www.digikey.com/en/products/detail/nxp-usa-inc/PCAL9555AHF-128/3598045> *PCAL9555A has pullups enabled by default, but remain configurable; DIGIKEY: 568-9947-1-ND; DISP: PCAL9535A; MF: NXP; MPN: PCAL9535AHF,128
U9 = bschulz:PCA9536: PCA9536 - I2C I/O Expander, 4 bit, 5V tollerant Characteristics: Vcc: 2.3V ~ 5.5V IOut: >10mA IQ: 1μA Operating Temperature: -40°C to 85°C Internal Pullups Digikey: 296-20952-1-ND (DGK) <https://www.digikey.com/product-detail/en/texas-instruments/PCA9536DGKR/296-20952-1-ND/1216922> 568-4079-1-ND (SON) <https://www.digikey.com/en/products/detail/nxp-usa-inc/PCA9536TK-118/1300978> *Datasheet for PCA9536TK does not explicitly specify connection of exposed pad, but using information from NXP engineering bulletin EB806 <https://www.nxp.com/docs/en/engineering-bulletin/EB806.pdf> for justification for connecting EP to GND. See page 4 "Freescale [NXP] recommends electrically connecting the exposed pad of QFN and DFN devices to MCU ground..."; DIGIKEY: 568-4079-1-ND; MF: NXP; MPN: PCA9536TK,118
U10 = bschulz:74HC4852: 74HC4852 - Analog Multiplexer, Dual 4-Channel (1:4 x 2) Characteristics: VCC: 2 ~ 6V RON: 195Ω RCh-Ch: 3Ω, max Operating Temperature: -40°C to 85°C Digikey: 1727-7953-1-ND <https://www.digikey.com/en/products/detail/nexperia-usa-inc/74HC4852BQ-Q100-11/3678903>; DIGIKEY: 1727-7953-1-ND; DISP: 74HC4852; MF: Nexperia; MPN: 74HC4852BQ-Q100,11
U11 = bschulz:SN74LVC1G3157: SN74LVC1G3157 - SPDT Analog Switch Characteristics: VCC: 1.65~5.5V Operating Temperature: -40°C to 85°C On state resistace: 15 Ω, Max Channel to Channel Matching: 0.1 Ω, Typical Digikey: 296-14909-1-ND (SC70, DCK) <https://www.digikey.com/product-detail/en/texas-instruments/SN74LVC1G3157DCKR/296-14909-1-ND/562526> 296-18015-1-ND (SOT-666, DRL) <https://www.digikey.com/product-detail/en/texas-instruments/SN74LVC1G3157DRLR/296-18015-1-ND/770530>; DIGIKEY: 296-14909-1-ND; DISP: SN74LVC1G3157; MF: TI; MPN: SN74LVC1G3157DCKR
U12 = bschulz:MCP342*: MCP342* - Sigma Delta ADC Characteristics: VCC: 2.7~5.5V Operating Temperature: -40°C to 125°C Number of Inputs: 1 (Differenital) Sample Rate: 15 Samples Per Second Number of Bits: 16 (MCP3425), 18 (MCP3421) Digikey: MCP3421 MCP3425A0T-E/CHCT-ND <https://www.digikey.com/product-detail/en/microchip-technology/MCP3425A0T-E-CH/MCP3425A0T-E-CHCT-ND/1979810> MCP3425 MCP3421A0T-E/CHCT-ND <https://www.digikey.com/product-detail/en/microchip-technology/MCP3421A0T-E-CH/MCP3421A0T-E-CHCT-ND/2183406> MCP3421A1T-E/CHCT-ND <https://www.digikey.com/product-detail/en/microchip-technology/MCP3421A1T-E-CH/MCP3421A1T-E-CHCT-ND/2183407> MCP3421A3T-E/CHCT-ND <https://www.digikey.com/product-detail/en/microchip-technology/MCP3421A3T-E-CH/MCP3421A3T-E-CHCT-ND/2183409>; DIGIKEY: MCP3421A3T-E/CHCT-ND; DISP: MCP3421; MF: Microchip; MPN: MCP3421A3T-E/CH
U13 = bschulz:FXMAR2102: FXMAR2102 - 2 Channel Bidirectional Voltage Level Translator for I2C Applications Characteristics: Vcc: 1.65 ~ 5.5V IQ: <5μA Output Current: 50mA Output Type: Open Drain/Push-Pull Operating Temperature: -40°C to 85°C Digikey: FXMAR2102UMX-F106CT-ND (UMLP) <https://www.digikey.com/en/products/detail/onsemi/FXMAR2102UMX-F106/5050715>; DIGIKEY: FXMAR2102UMX-F106CT-ND; DISP: FXMAR2102; MF: OnSemi; MPN: FXMAR2102UMX-F106
U14-U17 = bschulz:PCA9617: PCA9617A - Level translating I2C Bus Repeater Characteristics: Vcc: 0.8V ~ 5.5V (VccA), 2.2V ~ 5.5V (VccB) IOut: 30mA IQ: 1.6mA Operating Temperature: -40°C to 85°C Digikey: 568-10211-1-ND (TSSOP8) <https://www.digikey.com/en/products/detail/nxp-usa-inc/PCA9617ADPJ/3991854?s=N4IgTCBcDaIKwDYAcBaAjABjGt6UDkARQOAIQBdAXyA>; DIGIKEY: 568-10953-1-ND; MF: NXP; MPN: PCA9617ATPZ
U18-U21 = bschulz:SN74AUP1G08: SN74AUP1G08 - AND, 1 Element, 2 Input Characteristics: VCC: 0.8 ~ 3.6v IQ = 0.5μA Operating Temperature: -40°C to 85°C Digikey: 296-19075-1-ND (DCK) <https://www.digikey.com/product-detail/en/texas-instruments/SN74AUP1G08DCKR/296-19075-1-ND/864306> 296-18650-1-ND (DRL) <https://www.digikey.com/product-detail/en/texas-instruments/SN74AUP1G08DRLR/296-18650-1-ND/863418> 296-17366-1-ND (YZP) <https://www.digikey.com/product-detail/en/texas-instruments/SN74AUP1G08YZPR/296-17366-1-ND/691784>; DIGIKEY: 296-19075-1-ND; MF: TI; MPN: SN74AUP1G08DCKR
U22 = bschulz:SN74*1G32: SN74x1G32 - Single OR Gate Characteristics: VCC: AUP: 0.8 ~ 3.6V LVC: 1.65 ~ 5.5V Operating Temperature: -40°C to 85°C (-40°C to 125°C for LVC Version) fmax = 2.5 MHz (for Vcc =1.65v, high for higher Vcc) Output Current = ± 4 mA (± 32 mA for LVC Version) Digikey: 296-18714-1-ND (AUP, SC-70) <https://www.digikey.com/en/products/detail/texas-instruments/SN74AUP1G32DCKR/863485> 296-26602-1-ND (LVC, SC-70) <https://www.digikey.com/en/products/detail/texas-instruments/SN74LVC1G32DCKT/1592054>; DIGIKEY: 296-18714-1-ND; DISP: SN74AUP1G32; MF: TI; MPN: SN74AUP1G32DCKR